# Altium schematic sheet LattePanda Module.SchDoc
size 594 x 420 mm
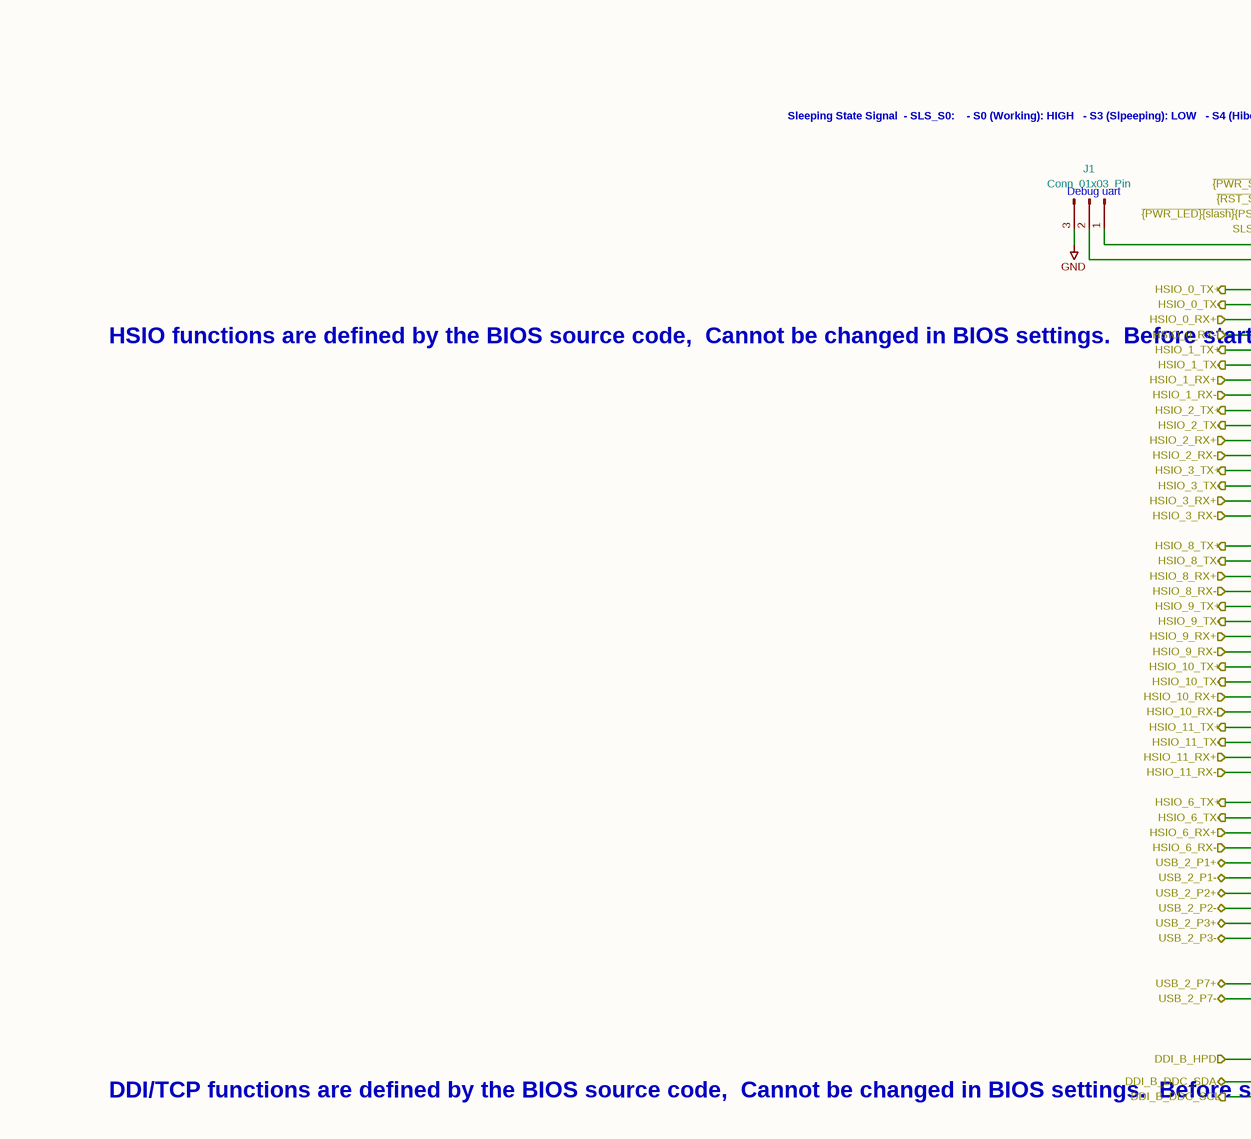
[diagram p0: LattePanda Module.SchDoc, top left]
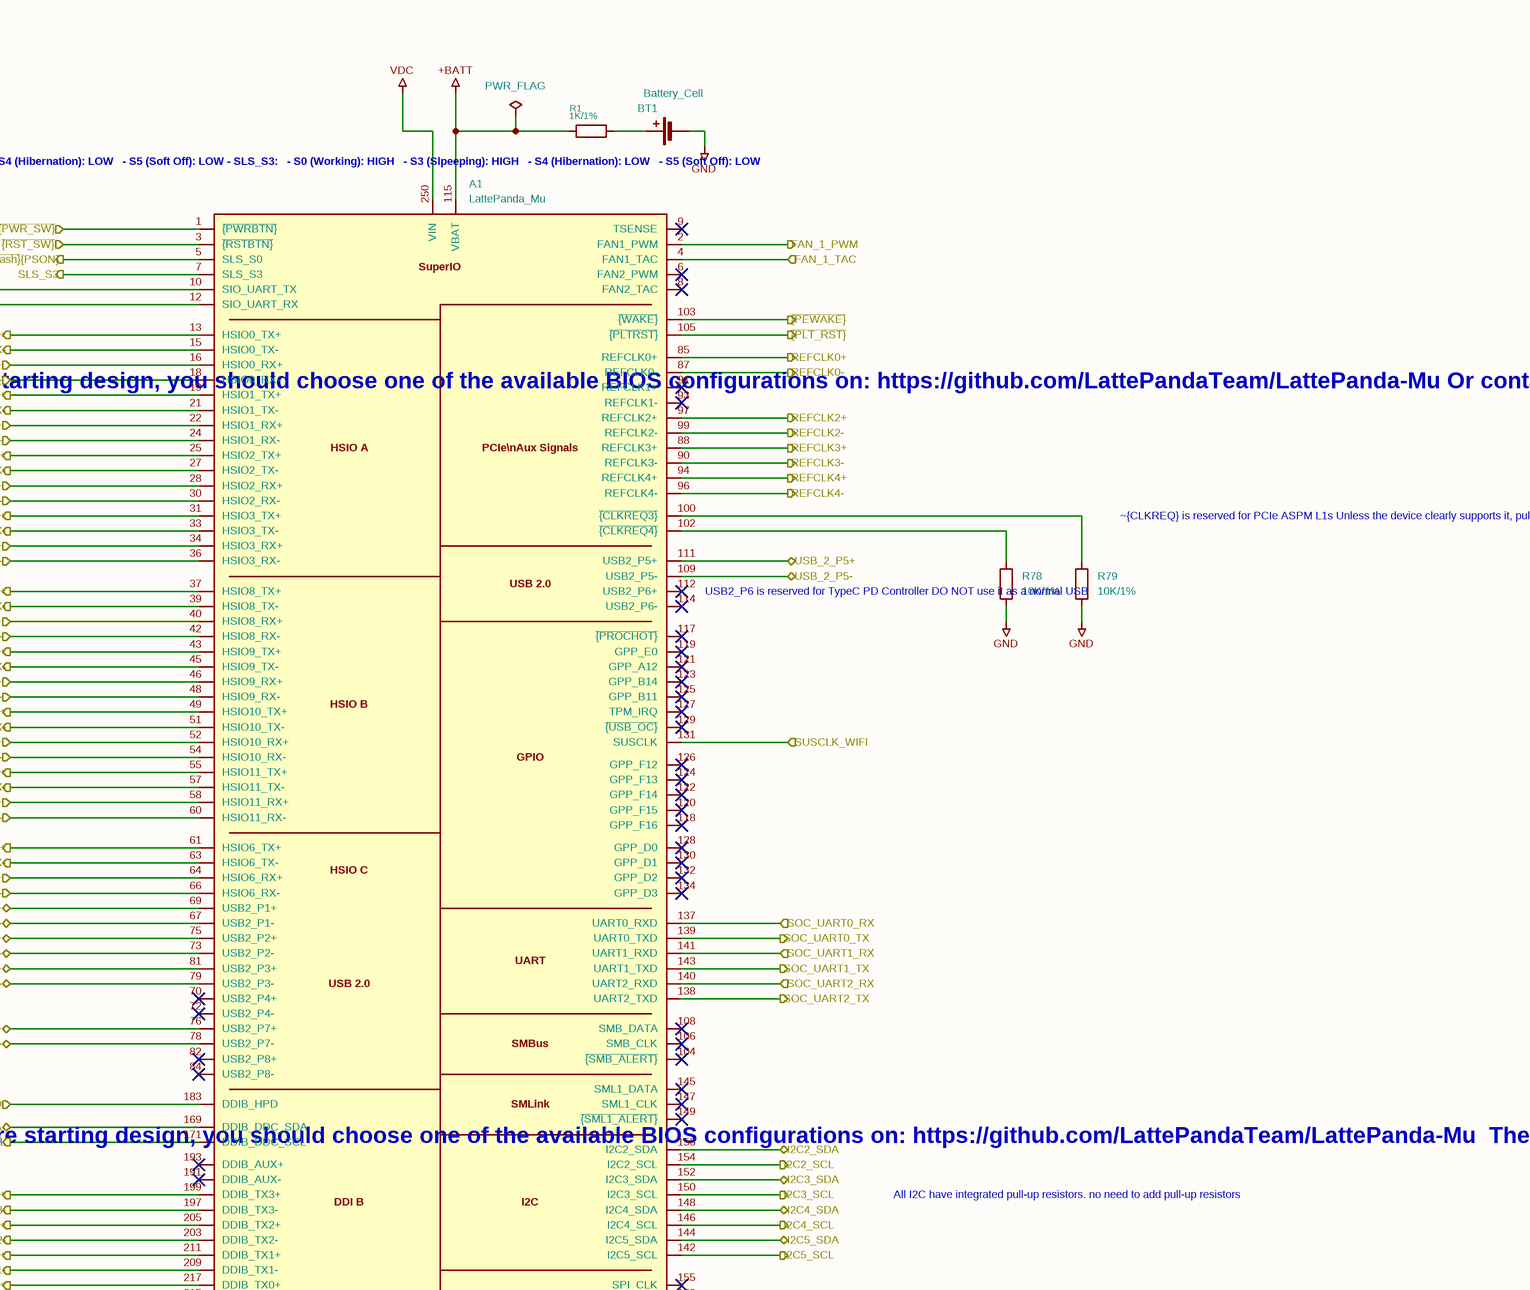
[diagram p1: LattePanda Module.SchDoc, top right]
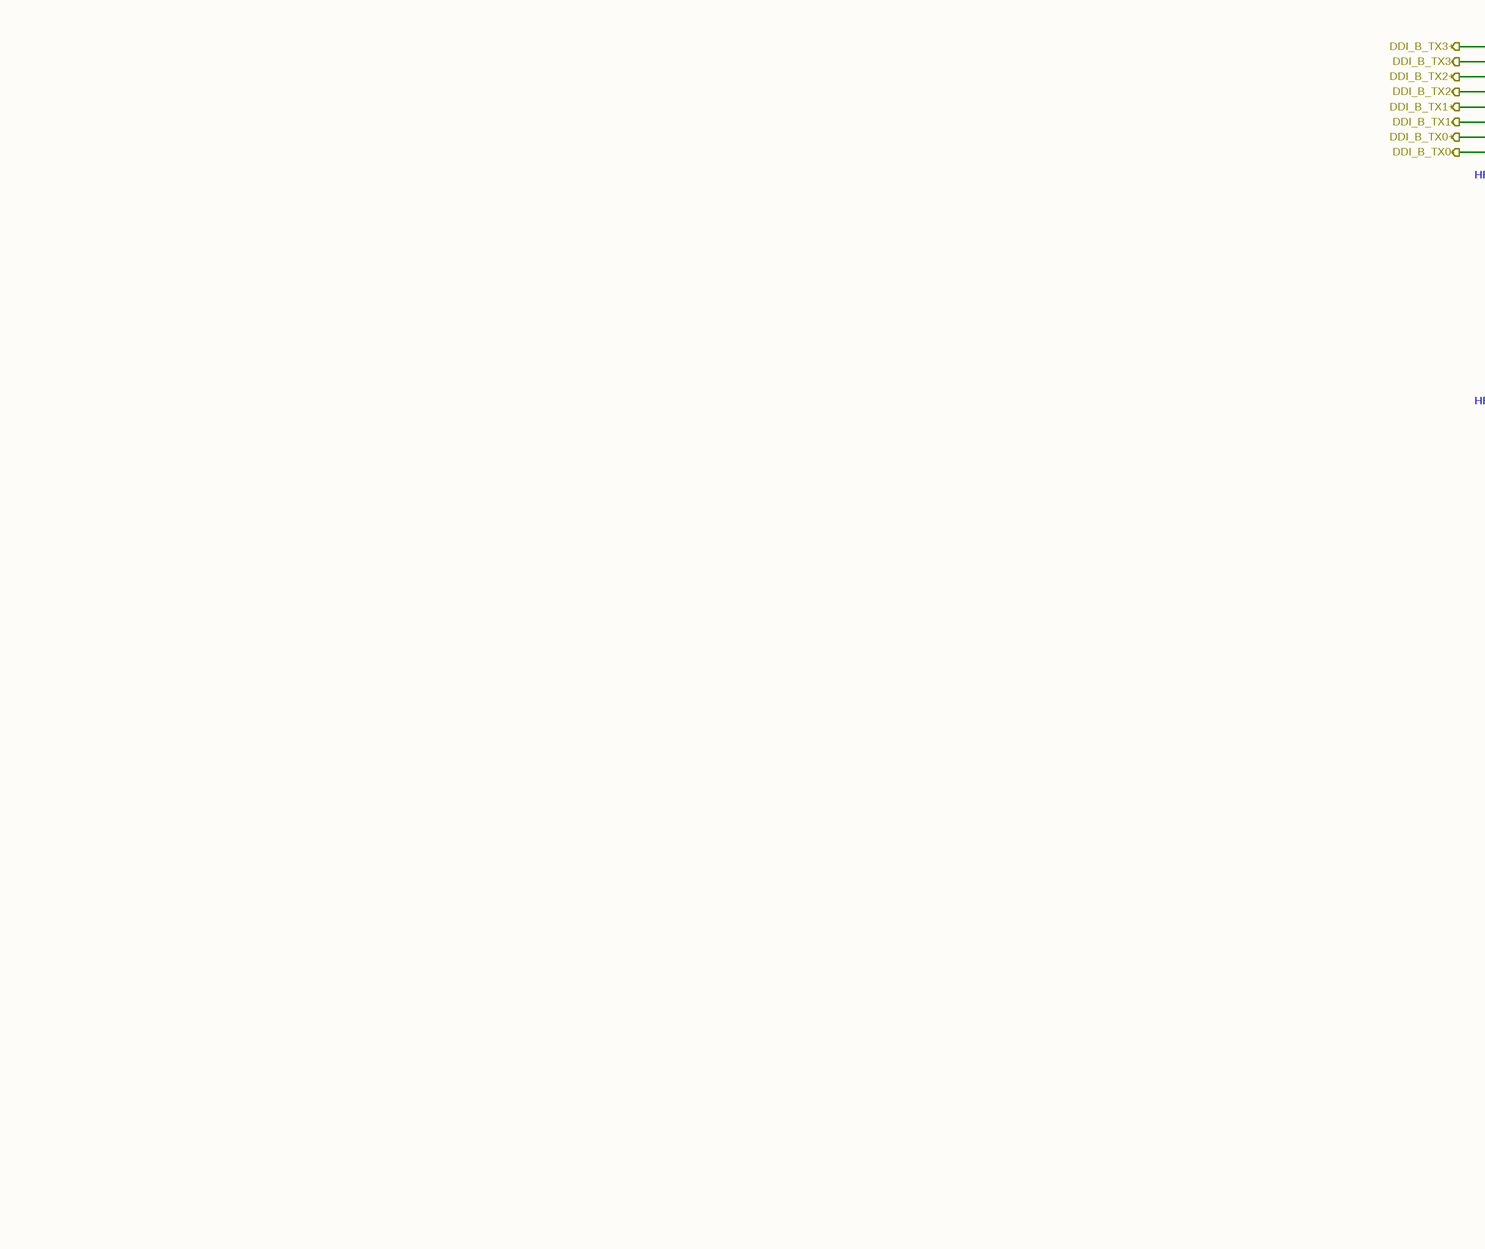
[diagram p2: LattePanda Module.SchDoc, bottom left]
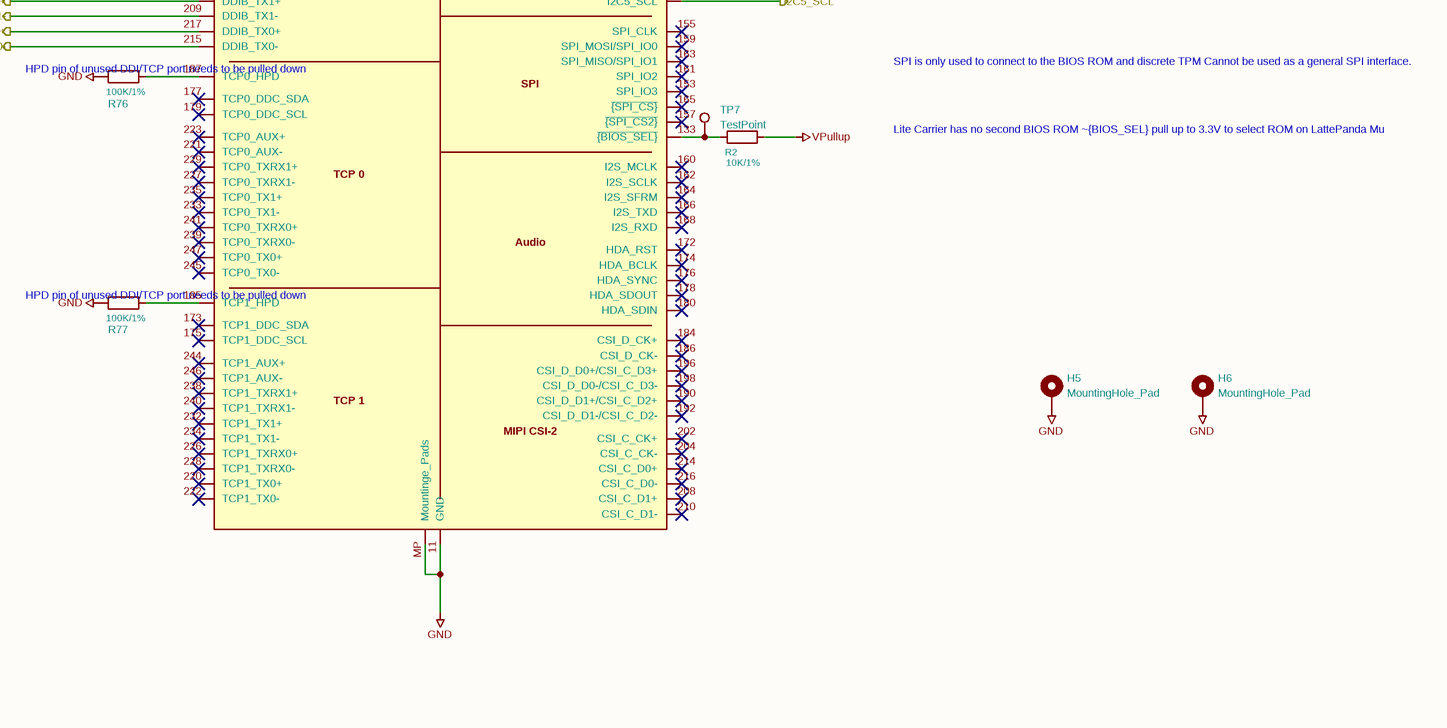
[diagram p3: LattePanda Module.SchDoc, bottom right]

## Parts
#FLG0201  PWR_FLAG  (graphical)
A1  LattePanda_Mu  [LattePanda_Module_H8.0mm_Horizontal]
BT1  Battery_Cell  [Battery_Holder_CR1220_S8411-45R]
H5  MountingHole_Pad  [MountingHole_3mm_M2_Pad_TopOnly]
H6  MountingHole_Pad  [MountingHole_3mm_M2_Pad_TopOnly]
J1  Conn_01x03_Pin  [PinHeader_1x03_P2.54mm_Vertical]
R1  1K/1%  [R_0402_1005Metric]
R2  10K/1%  [R_0402_1005Metric]
R76  100K/1%  [R_0402_1005Metric]
R77  100K/1%  [R_0402_1005Metric]
R78  10K/1%  [R_0402_1005Metric]
R79  10K/1%  [R_0402_1005Metric]
TP7  TestPoint  [TestPoint_Pad_D1.5mm]

## Ports
DDI_B_DDC_SCL (out), DDI_B_DDC_SDA (bidir), DDI_B_HPD (in), DDI_B_TX0+ (out), DDI_B_TX0- (out), DDI_B_TX1+ (out), DDI_B_TX1- (out), DDI_B_TX2+ (out), DDI_B_TX2- (out), DDI_B_TX3+ (out), DDI_B_TX3- (out), FAN_1_PWM (out), FAN_1_TAC (in), HSIO_0_RX+ (in), HSIO_0_RX- (in), HSIO_0_TX+ (out), HSIO_0_TX- (out), HSIO_1_RX+ (in), HSIO_1_RX- (in), HSIO_1_TX+ (out), HSIO_1_TX- (out), HSIO_2_RX+ (in), HSIO_2_RX- (in), HSIO_2_TX+ (out), HSIO_2_TX- (out), HSIO_3_RX+ (in), HSIO_3_RX- (in), HSIO_3_TX+ (out), HSIO_3_TX- (out), HSIO_6_RX+ (in), HSIO_6_RX- (in), HSIO_6_TX+ (out), HSIO_6_TX- (out), HSIO_8_RX+ (in), HSIO_8_RX- (in), HSIO_8_TX+ (out), HSIO_8_TX- (out), HSIO_9_RX+ (in), HSIO_9_RX- (in), HSIO_9_TX+ (out), HSIO_9_TX- (out), HSIO_10_RX+ (in), HSIO_10_RX- (in), HSIO_10_TX+ (out), HSIO_10_TX- (out), HSIO_11_RX+ (in), HSIO_11_RX- (in), HSIO_11_TX+ (out), HSIO_11_TX- (out), I2C2_SCL (out), I2C2_SDA (bidir), I2C3_SCL (out), I2C3_SDA (bidir), I2C4_SCL (out), I2C4_SDA (bidir), I2C5_SCL (out), I2C5_SDA (bidir), REFCLK0+ (out), REFCLK0- (out), REFCLK2+ (out), REFCLK2- (out), REFCLK3+ (out), REFCLK3- (out), REFCLK4+ (out), REFCLK4- (out), SLS_S3 (out), SOC_UART0_RX (in), SOC_UART0_TX (out), SOC_UART1_RX (in), SOC_UART1_TX (out), SOC_UART2_RX (in), SOC_UART2_TX (out), SUSCLK_WIFI (in), USB_2_P1+ (bidir), USB_2_P1- (bidir), USB_2_P2+ (bidir), USB_2_P2- (bidir), USB_2_P3+ (bidir), USB_2_P3- (bidir), USB_2_P5+ (bidir), USB_2_P5- (bidir), USB_2_P7+ (bidir), USB_2_P7- (bidir), ~{{PEWAKE}} (out), ~{{PLT_RST}} (out), ~{{PWR_LED}{slash}}{PSON} (out), ~{{PWR_SW}} (in), ~{{RST_SW}} (in)

## Nets
+BATT: #FLG0201.1 A1.115(VBAT) R1.1
GND: A1.11(GND) A1.MP(Mountinge_Pads) BT1.2(-) H5.1 H6.1 J1.3(Pin_3) R76.2 R77.2 R78.2 R79.2
VDC: A1.250(VIN)
VPullup: R2.2
DDI_B_DDC_SCL: A1.171(DDIB_DDC_SCL) ; port DDI_B_DDC_SCL
DDI_B_DDC_SDA: A1.169(DDIB_DDC_SDA) ; port DDI_B_DDC_SDA
DDI_B_HPD: A1.183(DDIB_HPD) ; port DDI_B_HPD
DDI_B_TX0+: A1.217(DDIB_TX0+) ; port DDI_B_TX0+
DDI_B_TX0-: A1.215(DDIB_TX0-) ; port DDI_B_TX0-
DDI_B_TX1+: A1.211(DDIB_TX1+) ; port DDI_B_TX1+
DDI_B_TX1-: A1.209(DDIB_TX1-) ; port DDI_B_TX1-
DDI_B_TX2+: A1.205(DDIB_TX2+) ; port DDI_B_TX2+
DDI_B_TX2-: A1.203(DDIB_TX2-) ; port DDI_B_TX2-
DDI_B_TX3+: A1.199(DDIB_TX3+) ; port DDI_B_TX3+
DDI_B_TX3-: A1.197(DDIB_TX3-) ; port DDI_B_TX3-
FAN_1_PWM: A1.2(FAN1_PWM) ; port FAN_1_PWM
FAN_1_TAC: A1.4(FAN1_TAC) ; port FAN_1_TAC
HSIO_0_RX+: A1.16(HSIO0_RX+) ; port HSIO_0_RX+
HSIO_0_RX-: A1.18(HSIO0_RX-) ; port HSIO_0_RX-
HSIO_0_TX+: A1.13(HSIO0_TX+) ; port HSIO_0_TX+
HSIO_0_TX-: A1.15(HSIO0_TX-) ; port HSIO_0_TX-
HSIO_1_RX+: A1.22(HSIO1_RX+) ; port HSIO_1_RX+
HSIO_1_RX-: A1.24(HSIO1_RX-) ; port HSIO_1_RX-
HSIO_1_TX+: A1.19(HSIO1_TX+) ; port HSIO_1_TX+
HSIO_1_TX-: A1.21(HSIO1_TX-) ; port HSIO_1_TX-
HSIO_2_RX+: A1.28(HSIO2_RX+) ; port HSIO_2_RX+
HSIO_2_RX-: A1.30(HSIO2_RX-) ; port HSIO_2_RX-
HSIO_2_TX+: A1.25(HSIO2_TX+) ; port HSIO_2_TX+
HSIO_2_TX-: A1.27(HSIO2_TX-) ; port HSIO_2_TX-
HSIO_3_RX+: A1.34(HSIO3_RX+) ; port HSIO_3_RX+
HSIO_3_RX-: A1.36(HSIO3_RX-) ; port HSIO_3_RX-
HSIO_3_TX+: A1.31(HSIO3_TX+) ; port HSIO_3_TX+
HSIO_3_TX-: A1.33(HSIO3_TX-) ; port HSIO_3_TX-
HSIO_6_RX+: A1.64(HSIO6_RX+) ; port HSIO_6_RX+
HSIO_6_RX-: A1.66(HSIO6_RX-) ; port HSIO_6_RX-
HSIO_6_TX+: A1.61(HSIO6_TX+) ; port HSIO_6_TX+
HSIO_6_TX-: A1.63(HSIO6_TX-) ; port HSIO_6_TX-
HSIO_8_RX+: A1.40(HSIO8_RX+) ; port HSIO_8_RX+
HSIO_8_RX-: A1.42(HSIO8_RX-) ; port HSIO_8_RX-
HSIO_8_TX+: A1.37(HSIO8_TX+) ; port HSIO_8_TX+
HSIO_8_TX-: A1.39(HSIO8_TX-) ; port HSIO_8_TX-
HSIO_9_RX+: A1.46(HSIO9_RX+) ; port HSIO_9_RX+
HSIO_9_RX-: A1.48(HSIO9_RX-) ; port HSIO_9_RX-
HSIO_9_TX+: A1.43(HSIO9_TX+) ; port HSIO_9_TX+
HSIO_9_TX-: A1.45(HSIO9_TX-) ; port HSIO_9_TX-
HSIO_10_RX+: A1.52(HSIO10_RX+) ; port HSIO_10_RX+
HSIO_10_RX-: A1.54(HSIO10_RX-) ; port HSIO_10_RX-
HSIO_10_TX+: A1.49(HSIO10_TX+) ; port HSIO_10_TX+
HSIO_10_TX-: A1.51(HSIO10_TX-) ; port HSIO_10_TX-
HSIO_11_RX+: A1.58(HSIO11_RX+) ; port HSIO_11_RX+
HSIO_11_RX-: A1.60(HSIO11_RX-) ; port HSIO_11_RX-
HSIO_11_TX+: A1.55(HSIO11_TX+) ; port HSIO_11_TX+
HSIO_11_TX-: A1.57(HSIO11_TX-) ; port HSIO_11_TX-
I2C2_SCL: A1.154(I2C2_SCL) ; port I2C2_SCL
I2C2_SDA: A1.156(I2C2_SDA) ; port I2C2_SDA
I2C3_SCL: A1.150(I2C3_SCL) ; port I2C3_SCL
I2C3_SDA: A1.152(I2C3_SDA) ; port I2C3_SDA
I2C4_SCL: A1.146(I2C4_SCL) ; port I2C4_SCL
I2C4_SDA: A1.148(I2C4_SDA) ; port I2C4_SDA
I2C5_SCL: A1.142(I2C5_SCL) ; port I2C5_SCL
I2C5_SDA: A1.144(I2C5_SDA) ; port I2C5_SDA
REFCLK0+: A1.85(REFCLK0+) ; port REFCLK0+
REFCLK0-: A1.87(REFCLK0-) ; port REFCLK0-
REFCLK2+: A1.97(REFCLK2+) ; port REFCLK2+
REFCLK2-: A1.99(REFCLK2-) ; port REFCLK2-
REFCLK3+: A1.88(REFCLK3+) ; port REFCLK3+
REFCLK3-: A1.90(REFCLK3-) ; port REFCLK3-
REFCLK4+: A1.94(REFCLK4+) ; port REFCLK4+
REFCLK4-: A1.96(REFCLK4-) ; port REFCLK4-
SLS_S3: A1.7(SLS_S3) ; port SLS_S3
SOC_UART0_RX: A1.137(UART0_RXD) ; port SOC_UART0_RX
SOC_UART0_TX: A1.139(UART0_TXD) ; port SOC_UART0_TX
SOC_UART1_RX: A1.141(UART1_RXD) ; port SOC_UART1_RX
SOC_UART1_TX: A1.143(UART1_TXD) ; port SOC_UART1_TX
SOC_UART2_RX: A1.140(UART2_RXD) ; port SOC_UART2_RX
SOC_UART2_TX: A1.138(UART2_TXD) ; port SOC_UART2_TX
SUSCLK_WIFI: A1.131(SUSCLK) ; port SUSCLK_WIFI
USB_2_P1+: A1.69(USB2_P1+) ; port USB_2_P1+
USB_2_P1-: A1.67(USB2_P1-) ; port USB_2_P1-
USB_2_P2+: A1.75(USB2_P2+) ; port USB_2_P2+
USB_2_P2-: A1.73(USB2_P2-) ; port USB_2_P2-
USB_2_P3+: A1.81(USB2_P3+) ; port USB_2_P3+
USB_2_P3-: A1.79(USB2_P3-) ; port USB_2_P3-
USB_2_P5+: A1.111(USB2_P5+) ; port USB_2_P5+
USB_2_P5-: A1.109(USB2_P5-) ; port USB_2_P5-
USB_2_P7+: A1.76(USB2_P7+) ; port USB_2_P7+
USB_2_P7-: A1.78(USB2_P7-) ; port USB_2_P7-
~{{PEWAKE}}: A1.103(~{{WAKE}}) ; port ~{{PEWAKE}}
~{{PLT_RST}}: A1.105(~{{PLTRST}}) ; port ~{{PLT_RST}}
~{{PWR_LED}{slash}}{PSON}: A1.5(SLS_S0) ; port ~{{PWR_LED}{slash}}{PSON}
~{{PWR_SW}}: A1.1(~{{PWRBTN}}) ; port ~{{PWR_SW}}
~{{RST_SW}}: A1.3(~{{RSTBTN}}) ; port ~{{RST_SW}}
NetA1_10: A1.10(SIO_UART_TX) J1.1(Pin_1)
NetA1_12: A1.12(SIO_UART_RX) J1.2(Pin_2)
NetA1_100: A1.100(~{{CLKREQ3}}) R79.1
NetA1_102: A1.102(~{{CLKREQ4}}) R78.1
NetA1_133: A1.133(~{{BIOS_SEL}}) R2.1 TP7.1
NetA1_185: A1.185(TCP1_HPD) R77.1
NetA1_187: A1.187(TCP0_HPD) R76.1
NetBT1_1: BT1.1(+) R1.2

Not connected (* = marked no-connect by the designer): A1 6(FAN2_PWM)* 8(FAN2_TAC)* 9(TSENSE)* 14(GND) 17(GND) 20(GND) 23(GND) 26(GND) 29(GND) 32(GND) 35(GND) 38(GND) 41(GND) 44(GND) 47(GND) 50(GND) 53(GND) 56(GND) 59(GND) 62(GND) 65(GND) 68(GND) 70(USB2_P4+)* 71(GND) 72(USB2_P4-)* 74(GND) 77(GND) 80(GND) 82(USB2_P8+)* 83(GND) 84(USB2_P8-)* 86(GND) 89(GND) 91(REFCLK1+)* 92(GND) 93(REFCLK1-)* 95(GND) 98(GND) 101(GND) 104(~{{SMB_ALERT}})* 106(SMB_CLK)* 107(GND) 108(SMB_DATA)* 110(GND) 112(USB2_P6+)* 113(GND) 114(USB2_P6-)* 116(GND) 117(~{{PROCHOT}})* 118(GPP_F16)* 119(GPP_E0)* 120(GPP_F15)* 121(GPP_A12)* 122(GPP_F14)* 123(GPP_B14)* 124(GPP_F13)* 125(GPP_B11)* 126(GPP_F12)* 127(TPM_IRQ)* 128(GPP_D0)* 129(~{{USB_OC}})* 130(GPP_D1)* 132(GPP_D2)* 134(GPP_D3)* 135(GND) 136(GND) 145(SML1_DATA)* 147(SML1_CLK)* 149(~{{SML1_ALERT}})* 151(GND) 153(SPI_IO3)* 155(SPI_CLK)* 157(~{{SPI_CS2}})* 158(GND) 159(SPI_MOSI/SPI_IO0)* 160(I2S_MCLK)* 161(SPI_IO2)* 162(I2S_SCLK)* 163(SPI_MISO/SPI_IO1)* 164(I2S_SFRM)* 165(~{{SPI_CS}})* 166(I2S_TXD)* 167(GND) 168(I2S_RXD)* 170(GND) 172(HDA_RST)* 173(TCP1_DDC_SDA)* 174(HDA_BCLK)* 175(TCP1_DDC_SCL)* 176(HDA_SYNC)* 177(TCP0_DDC_SDA)* 178(HDA_SDOUT)* 179(TCP0_DDC_SCL)* 180(HDA_SDIN)* 181(GND) 182(GND) 184(CSI_D_CK+)* 186(CSI_D_CK-)* 188(GND) 189(GND) 190(CSI_D_D1+/CSI_C_D2+)* 191(DDIB_AUX-)* 192(CSI_D_D1-/CSI_C_D2-)* 193(DDIB_AUX+)* 194(GND) 195(GND) 196(CSI_D_D0+/CSI_C_D3+)* 198(CSI_D_D0-/CSI_C_D3-)* 200(GND) 201(GND) 202(CSI_C_CK+)* 204(CSI_C_CK-)* 206(GND) 207(GND) 208(CSI_C_D1+)* 210(CSI_C_D1-)* 212(GND) 213(GND) 214(CSI_C_D0+)* 216(CSI_C_D0-)* 218(GND) 219(GND) 220(TCP1_TX0+)* 221(TCP0_AUX-)* 222(TCP1_TX0-)* 223(TCP0_AUX+)* 224(GND) 225(GND) 226(TCP1_TXRX0+)* 227(TCP0_TXRX1-)* 228(TCP1_TXRX0-)* 229(TCP0_TXRX1+)* 230(GND) 231(GND) 232(TCP1_TX1+)* 233(TCP0_TX1-)* 234(TCP1_TX1-)* 235(TCP0_TX1+)* 236(GND) 237(GND) 238(TCP1_TXRX1+)* 239(TCP0_TXRX0-)* 240(TCP1_TXRX1-)* 241(TCP0_TXRX0+)* 242(GND) 243(GND) 244(TCP1_AUX+)* 245(TCP0_TX0-)* 246(TCP1_AUX-)* 247(TCP0_TX0+)* 248(GND) 249(GND) 251(VIN) 252(VIN) 253(VIN) 254(VIN) 255(VIN) 256(VIN) 257(VIN) 258(VIN) 259(VIN) 260(VIN)

## Notes on the sheet
- Sleeping State Signal
  - SLS_S0:
  - S0 (Working): HIGH
  - S3 (Slpeeping): LOW
  - S4 (Hibernation): LOW
  - S5 (Soft Off): LOW
  - SLS_S3:
  - S0 (Working): HIGH
  - S3 (Slpeeping): HIGH
  - S4 (Hibernation): LOW
  - S5 (Soft Off): LOW
- (near J1) Debug uart
- (near A1) HSIO functions are defined by the BIOS source code,
  Cannot be changed in BIOS settings.
  Before starting design, you should choose one of
  the available BIOS configurations on:
  https://github.com/LattePandaTeam/LattePanda-Mu
  Or contact techsupport for custom your BIOS
  The default functions are defined as follows:
  - HSIO0: USB3.2 10Gbps
  - HSIO1: USB3.2 10Gbps
  - HSIO2: PCIe 3.0 x1
  - HSIO3: PCIe 3.0 x1
  - HSIO8: PCIe 3.0 x4 (Lane 0)
  - HSIO9: PCIe 3.0 x4 (Lane 1)
  - HSIO10: PCIe 3.0 x4 (Lane 2)
  - HSIO11: PCIe 3.0 x4 (Lane 3)
  - HSIO6: PCIe 3.0 x1
- (near R79) ~{CLKREQ} is reserved for PCIe ASPM L1s
  Unless the device clearly supports it, pull it down to enhance compatibility
- USB2_P6 is reserved for TypeC PD Controller
  DO NOT use it as a normal USB
- (near A1) DDI/TCP functions are defined by the BIOS source code,
  Cannot be changed in BIOS settings.
  Before starting design, you should choose one of
  the available BIOS configurations on:
  https://github.com/LattePandaTeam/LattePanda-Mu
  The default functions are defined as follows:
  - DDIA: eDP 1.4b (the 40Pin connector on the Mu)
  - DDIB: HDMI 2.0
  - TCP0: HDMI 2.0
  - TCP1: USB TypeC (need external PD controller)
- All I2C have integrated pull-up resistors.
  no need to add pull-up resistors
- HPD pin of unused DDI/TCP port
  needs to be pulled down
- SPI is only used to connect to the BIOS ROM and discrete TPM
  Cannot be used as a general SPI interface.
- Lite Carrier has no second BIOS ROM
  ~{BIOS_SEL} pull up to 3.3V to select ROM on LattePanda Mu
- 1
- 2
- 3
- 4
- 5
- 6
- 7
- 8
- 9
- 10
- 11
- A
- B
- C
- D
- E
- F
- G
- H
- 20240406
- Title: Primer Carrier for LattePanda Mu
- File: LattePanda Module.kicad_sch
- Sheet: /
- DFRobot
- KiCad E.D.A.  kicad (5.1.4)-1
- Size: A2
- Date: 2024-04-06
- Rev: V1.0.0
- Id: 1/1
- (in symbol LattePanda_Mu) SuperIO; HSIO A; PCIe\nAux Signals; USB 2.0; HSIO B; GPIO; HSIO C; UART; SMBus; SMLink; DDI B; I2C; SPI; TCP 0; Audio; TCP 1; MIPI CSI-2

## Library data of the parts
R1 R2 R76-R79 = R
  R1: Value: 1K/1%; Footprint: A_HDJ_Library:R_0402_1005Metric
  R2: Value: 10K/1%; Footprint: A_HDJ_Library:R_0402_1005Metric
  R76 R77: Value: 100K/1%; Footprint: A_HDJ_Library:R_0402_1005Metric
  R78 R79: Value: 10K/1%; Footprint: Resistor_SMD:R_0402_1005Metric
#FLG0201 = PWR_FLAG: Value: PWR_FLAG
A1 = LattePanda_Mu: Value: LattePanda_Mu; Footprint: Module_LattePanda:LattePanda_Module_H8.0mm_Horizontal
BT1 = Battery_Cell: Value: Battery_Cell; Footprint: A_HDJ_Library:Battery_Holder_CR1220_S8411-45R
H5 H6 = MountingHole_Pad: Value: MountingHole_Pad; Footprint: A_HDJ_Library:MountingHole_3mm_M2_Pad_TopOnly
J1 = Conn_01x03_Pin: Value: Conn_01x03_Pin; Footprint: A_HDJ_Library:PinHeader_1x03_P2.54mm_Vertical
TP7 = TestPoint: Value: TestPoint; Footprint: A_HDJ_Library:TestPoint_Pad_D1.5mm